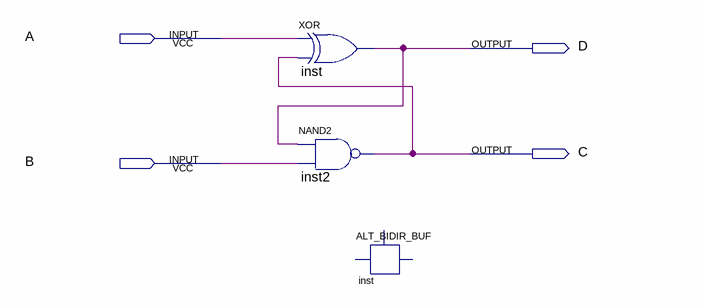
[diagram p0: schematic sheet]
// Quartus schematic Prueba1.bdf as structural Verilog: 3 symbols, 4 pins
module Prueba1 (
  input  A,
  input  B,
  output D,
  output C
);

  xor inst (D, A, C);
  nand inst2 (C, D, B);
  ALT_BIDIR_BUF inst_dup2 ();  // open: oe, bidirin, io
endmodule
